# Altium schematic sheet CPU.schdoc
size 569 x 341 mm
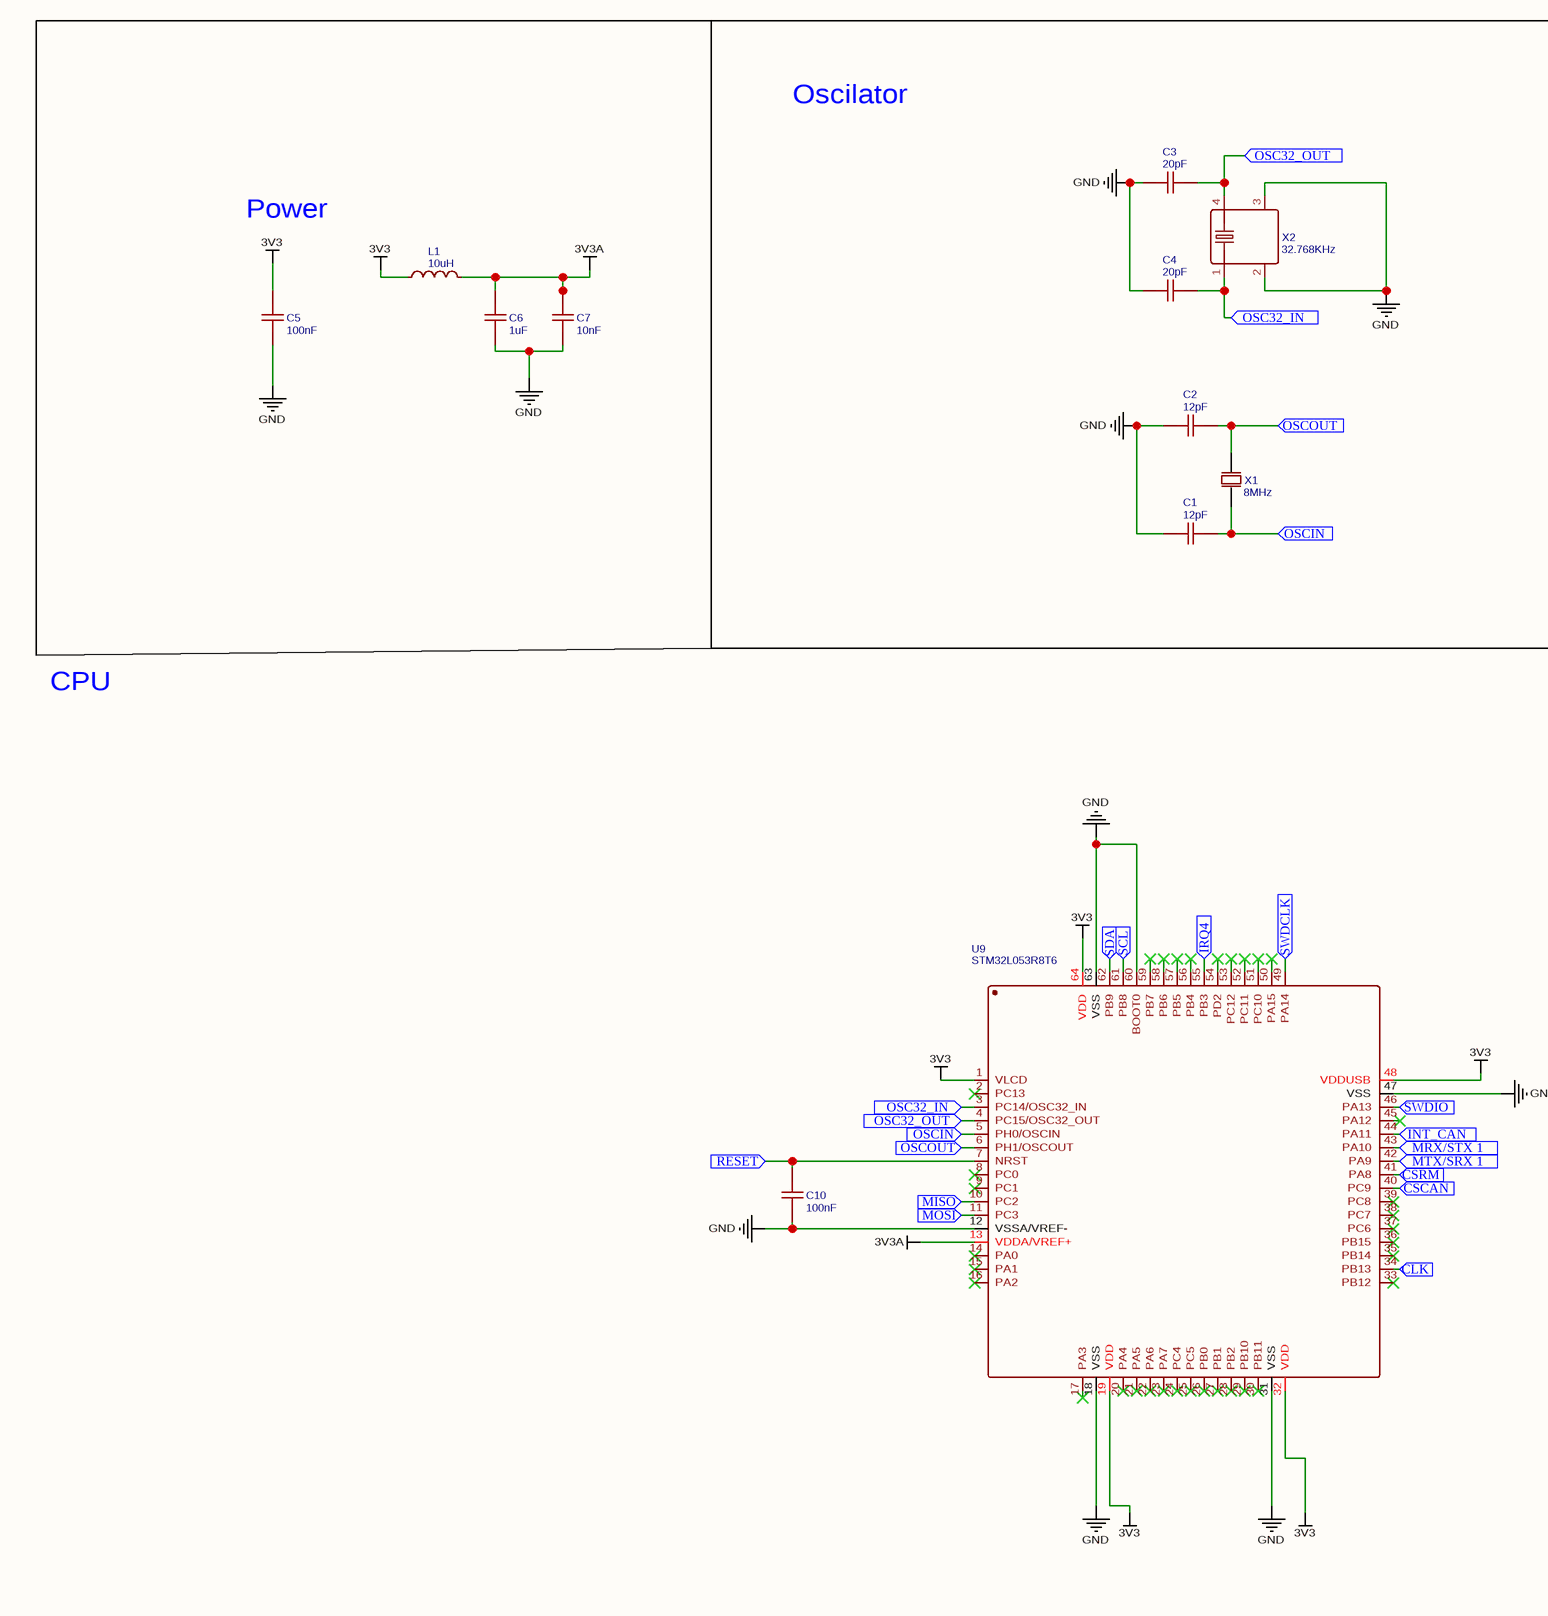
[diagram p0: CPU.schdoc, left]
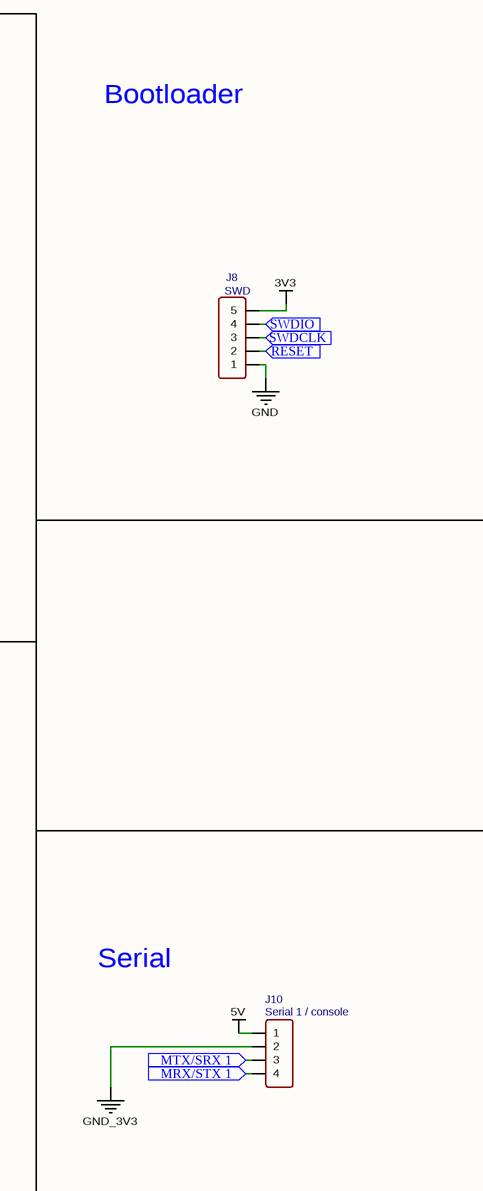
[diagram p1: CPU.schdoc, right]

## Parts
C1  12pF  [C0805]
C2  12pF  [C0805]
C3  20pF  [C0805]
C4  20pF  [C0805]
C5  100nF  [C0805]
C6  1uF  [C0805]
C7  10nF  [C0805]
C10  100nF  [C0805]
J8  SWD  [HDR-M-2.54_1X5]
J10  Serial 1 / console  [HDR-M-2.54_1X4]
L1  10uH  [L1206]
U9  STM32L053R8T6  [LQFP-64_L10.0-W10.0-P0.50-LS12.0-BL]
X1  8MHz  [OSC-SMD_L5.0-W3.2]
X2  32.768KHz  [MC-306_4P-L8.0-W3.2-P5.5-BL]

## Blocks framed on the sheet
Power: C5-C7 L1
Oscilator: C1-C4 X1 X2
Serial: J10

## Ports
CLK (in), CSCAN (in), CSRM (in), INT_CAN (in), IRQ4 (in), MISO (in), MOSI (in), MRX/STX 1 (in), MTX/SRX 1 (in), OSC32_IN (in), OSC32_OUT (in), OSCIN (in), OSCOUT (in), RESET (in), SCL (in), SDA (in), SWDCLK (in), SWDIO (in)

## Nets
3V3: C5.2 J8.5 L1.1 U9.1(VLCD) U9.19(VDD) U9.32(VDD) U9.48(VDDUSB) U9.64(VDD)
3V3A: C6.2 C7.2 L1.2 U9.13(VDDA/VREF+)
5V: J10.1
GND: C1.1 C2.1 C3.1 C4.1 C5.1 C6.1 C7.1 C10.1 J8.1 U9.12(VSSA/VREF-) U9.18(VSS) U9.31(VSS) U9.47(VSS) U9.60(BOOT0) U9.63(VSS) X2.2 X2.3
GND_3V3: J10.2
CLK: U9.34(PB13) ; port CLK
CSCAN: U9.40(PC9) ; port CSCAN
CSRM: U9.41(PA8) ; port CSRM
INT_CAN: U9.44(PA11) ; port INT_CAN
IRQ4: U9.55(PB3) ; port IRQ4
MISO: U9.10(PC2) ; port MISO
MOSI: U9.11(PC3) ; port MOSI
MRX/STX 1: J10.4 U9.43(PA10) ; port MRX/STX 1
MTX/SRX 1: J10.3 U9.42(PA9) ; port MTX/SRX 1
OSC32_IN: C4.2 U9.3(PC14/OSC32_IN) X2.1 ; port OSC32_IN
OSC32_OUT: C3.2 U9.4(PC15/OSC32_OUT) X2.4 ; port OSC32_OUT
OSCIN: C1.2 U9.5(PH0/OSCIN) X1.1(OSC1) ; port OSCIN
OSCOUT: C2.2 U9.6(PH1/OSCOUT) X1.2(OSC2) ; port OSCOUT
RESET: C10.2 J8.2 U9.7(NRST) ; port RESET
SCL: U9.61(PB8) ; port SCL
SDA: U9.62(PB9) ; port SDA
SWDCLK: J8.3 U9.49(PA14) ; port SWDCLK
SWDIO: J8.4 U9.46(PA13) ; port SWDIO

Not connected (* = marked no-connect by the designer): U9 2(PC13)* 8(PC0)* 9(PC1)* 14(PA0)* 15(PA1)* 16(PA2)* 17(PA3)* 20(PA4)* 21(PA5)* 22(PA6)* 23(PA7)* 24(PC4)* 25(PC5)* 26(PB0)* 27(PB1)* 28(PB2)* 29(PB10)* 30(PB11)* 33(PB12)* 35(PB14)* 36(PB15)* 37(PC6)* 38(PC7)* 39(PC8)* 45(PA12)* 50(PA15)* 51(PC10)* 52(PC11)* 53(PC12)* 54(PD2)* 56(PB4)* 57(PB5)* 58(PB6)* 59(PB7)*

## Notes on the sheet
- Bootloader
- CPU

## Library data of the parts
C1 C2 = 12pF: BOM_Manufacturer Part: CL21C120JBANNNC; BOM_Manufacturer: SAMSUNG(三星); nameAlias: Value(F); Contributor: LCEDA_Lib; BOM_Supplier Part: C170110; BOM_Supplier: LCSC; spicePre: C; spiceSymbolName: C_0805_US
C3 C4 = 20pF: BOM_Manufacturer Part: CC0805JRNPO9BN200; BOM_Manufacturer: YAGEO(国巨); nameAlias: Value(F); Contributor: LCEDA_Lib; BOM_Supplier Part: C105173; BOM_Supplier: LCSC; spicePre: C; spiceSymbolName: C_0805_US
C5 C10 = 100nF: BOM_Manufacturer Part: CC0805KRX7R9BB104; BOM_Manufacturer: YAGEO(国巨); nameAlias: Value(F); Contributor: LCEDA_Lib; BOM_Supplier Part: C49678; BOM_Supplier: LCSC; spicePre: C; spiceSymbolName: C_0805_US
C6 = 1uF: BOM_Manufacturer Part: GRM21BR71E105KA99L; BOM_Manufacturer: muRata(村田); nameAlias: Value(F); Contributor: LCEDA_Lib; BOM_Supplier Part: C77080; BOM_Supplier: LCSC; spicePre: C; spiceSymbolName: C_0805_US
C7 = 10nF: BOM_Manufacturer Part: 0805CG103J500NT; BOM_Manufacturer: FH(风华); nameAlias: Value(F); Contributor: LCEDA_Lib; BOM_Supplier Part: C2971995; BOM_Supplier: LCSC; spicePre: C; spiceSymbolName: C_0805_US
J8 = SWD: Contributor: LCEDA_Lib; BOM_Supplier Part: C358687; BOM_Supplier: LCSC; spicePre: J; spiceSymbolName: HDR-M-2.54_1x5
J10 = Serial 1 / console: Contributor: LCEDA_Lib; BOM_Supplier Part: C124378; BOM_Supplier: LCSC; spicePre: J; spiceSymbolName: HDR-M-2.54_1x4
L1 = 10uH: BOM_Manufacturer: FH; BOM_Manufacturer Part: CMI321609X100KT; nameAlias: Inductance; BOM_Supplier: LCSC; BOM_Supplier Part: C1051; spicePre: L; spiceSymbolName: CBC3225T100KR
U9 = STM32L053R8T6: BOM_Manufacturer: ST(意法半导体); BOM_Manufacturer Part: STM32L053R6T6; SMT Type: Extend; BOM_Paste Type: expand; BOM_Supplier: LCSC; BOM_Supplier Part: C1339433; BOM_JLCPCB SMD: Yes; BOM_LCSC Assembly: Yes; spicePre: U; spiceSymbolName: STM32L053R8T6
X1 = 8MHz: BOM_Manufacturer: YXC; BOM_Manufacturer Part: X50328MSB2GI; nameAlias: Frequency; SMT Type: Basic; BOM_Paste Type: base; BOM_Supplier: LCSC; BOM_Supplier Part: C115962; BOM_JLCPCB SMD: Yes; BOM_LCSC Assembly: Yes; spicePre: X; spiceSymbolName: X50328MSB2GI
X2 = 32.768KHz: BOM_Manufacturer: EPSON; BOM_Manufacturer Part: MC-306 32.768kHz 6.0pF 20ppm; nameAlias: Frequency; Contributor: LCSC; SMT Type: Extend; BOM_Paste Type: expand; BOM_Supplier: LCSC; BOM_Supplier Part: C83979; BOM_JLCPCB SMD: Yes; BOM_LCSC Assembly: Yes; spicePre: X; spiceSymbolName: MC-306 32.768kHz 6.0pF 20ppm